# EAGLE design RG_Medium_Matrix-v11 (EAGLE 6.4)
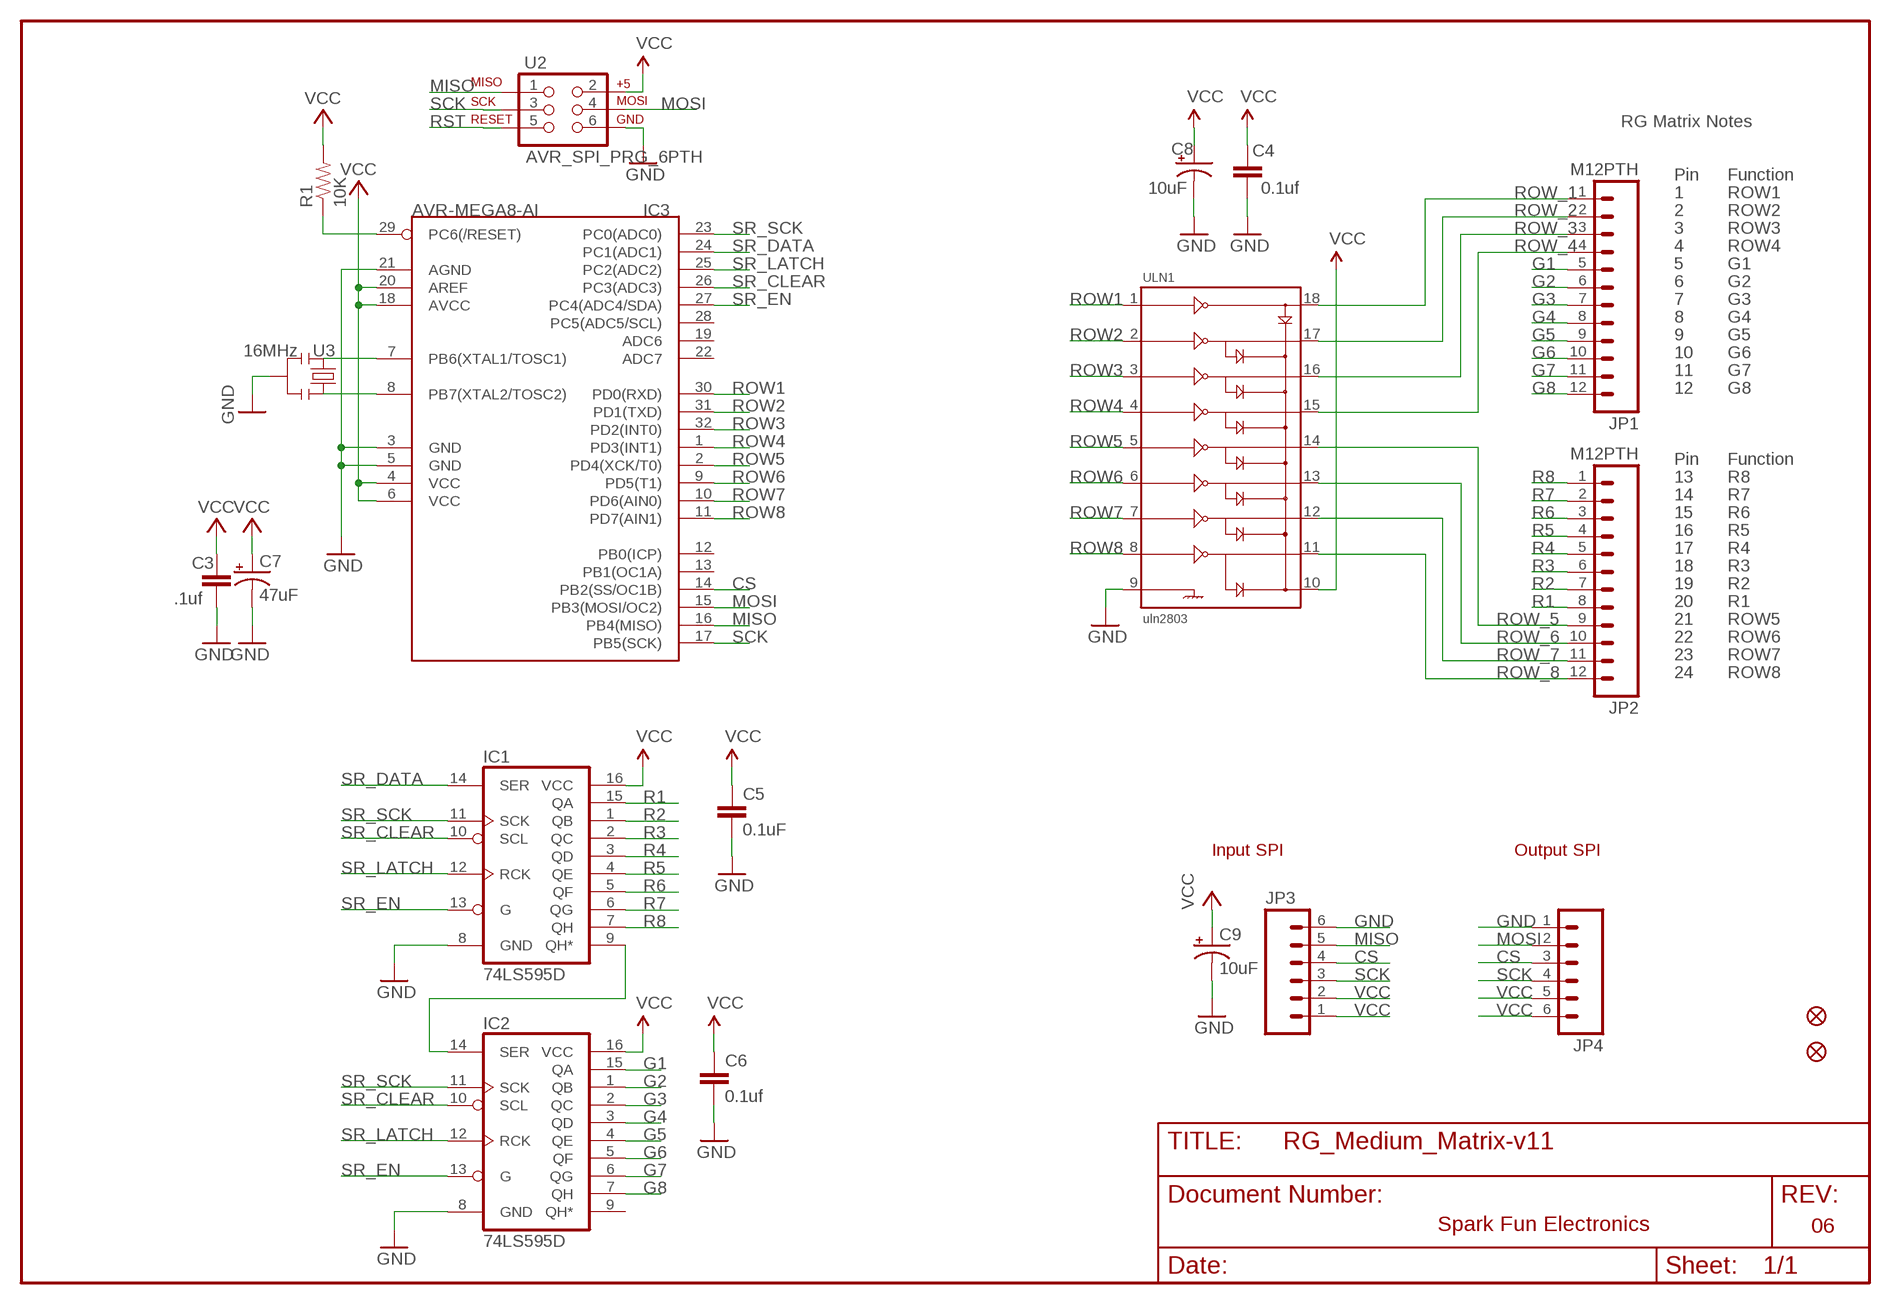
[diagram p0: schematic, sheet 1]

## Parts
C3  .1uf  CAP0402  [C0402]
C4  0.1uf  CAP0402  [C0402]
C5  0.1uF  CAP0402  [C0402]
C6  0.1uf  CAP0402  [C0402]
C7  47uF  CAP_POL3528  [EIA3528]
C8  10uF  CAP_POL1206  [EIA3216]
C9  10uF  CAP_POL1206  [EIA3216]
IC1  74LS595D  [SO16]
IC2  74LS595D  [SO16]
IC3  AVR-MEGA8-AI  [TQFP32-08]
JP1  M12PTH  [1X12]
JP2  M12PTH  [1X12]
JP3  M06SMD  [1X06-SMD]
JP4  M06SIP  [1X06]
R1  10K  RESISTOR0402  [C0402]
U2  AVR_SPI_PRG_6PTH  [2X3]
U3  16MHz  RESONATORSMD  [RESONATOR-SMD]
U$1  FIDUCIAL1X2  [FIDUCIAL-1X2]
U$3  FIDUCIAL1X2  [FIDUCIAL-1X2]
ULN1  uln2803  ULN2803SOICW  [SO18L]

## Nets
CS: IC3.14(PB2(SS/OC1B)) JP3.4 JP4.3
G1: IC2.15(QA) JP1.5
G2: IC2.1(QB) JP1.6
G3: IC2.2(QC) JP1.7
G4: IC2.3(QD) JP1.8
G5: IC2.4(QE) JP1.9
G6: IC2.5(QF) JP1.10
G7: IC2.6(QG) JP1.11
G8: IC2.7(QH) JP1.12
GND: C3.2 C4.1 C5.2 C6.2 C7.C(-) C8.C(-) C9.C(-) IC1.8(GND) IC2.8(GND) IC3.3(GND) IC3.5(GND) IC3.21(AGND) JP3.6 JP4.1 U2.6 U3.2 ULN1.9
MISO: IC3.16(PB4(MISO)) JP3.5 U2.1
MOSI: IC3.15(PB3(MOSI/OC2)) JP4.2 U2.4
N$1: IC3.7(PB6(XTAL1/TOSC1)) U3.1
N$2: IC3.8(PB7(XTAL2/TOSC2)) U3.3
N$30: IC1.9(QH*) IC2.14(SER)
R1: IC1.15(QA) JP2.8
R2: IC1.1(QB) JP2.7
R3: IC1.2(QC) JP2.6
R4: IC1.3(QD) JP2.5
R5: IC1.4(QE) JP2.4
R6: IC1.5(QF) JP2.3
R7: IC1.6(QG) JP2.2
R8: IC1.7(QH) JP2.1
ROW1: IC3.30(PD0(RXD)) ULN1.1
ROW2: IC3.31(PD1(TXD)) ULN1.2
ROW3: IC3.32(PD2(INT0)) ULN1.3
ROW4: IC3.1(PD3(INT1)) ULN1.4
ROW5: IC3.2(PD4(XCK/T0)) ULN1.5
ROW6: IC3.9(PD5(T1)) ULN1.6
ROW7: IC3.10(PD6(AIN0)) ULN1.7
ROW8: IC3.11(PD7(AIN1)) ULN1.8
ROW_1: JP1.1 ULN1.18
ROW_2: JP1.2 ULN1.17
ROW_3: JP1.3 ULN1.16
ROW_4: JP1.4 ULN1.15
ROW_5: JP2.9 ULN1.14
ROW_6: JP2.10 ULN1.13
ROW_7: JP2.11 ULN1.12
ROW_8: JP2.12 ULN1.11
RST: IC3.29(PC6(/RESET)) R1.1 U2.5
SCK: IC3.17(PB5(SCK)) JP3.3 JP4.4 U2.3
SR_CLEAR: IC1.10(SCL) IC2.10(SCL) IC3.26(PC3(ADC3))
SR_DATA: IC1.14(SER) IC3.24(PC1(ADC1))
SR_EN: IC1.13(G) IC2.13(G) IC3.27(PC4(ADC4/SDA))
SR_LATCH: IC1.12(RCK) IC2.12(RCK) IC3.25(PC2(ADC2))
SR_SCK: IC1.11(SCK) IC2.11(SCK) IC3.23(PC0(ADC0))
VCC: C3.1 C4.2 C5.1 C6.1 C7.A(+) C8.A(+) C9.A(+) IC1.16(VCC) IC2.16(VCC) IC3.4(VCC) IC3.6(VCC) IC3.18(AVCC) IC3.20(AREF) JP3.1 JP3.2 JP4.5 JP4.6 R1.2 U2.2 ULN1.10
Unconnected: IC2.9(QH*) IC3.12(PB0(ICP)) IC3.13(PB1(OC1A)) IC3.19(ADC6) IC3.22(ADC7) IC3.28(PC5(ADC5/SCL))

## Notes on the sheet
- RG Matrix Notes
- Pin | Function
- 1 | ROW1
- 2 | ROW2
- 3 | ROW3
- 4 | ROW4
- 5 | G1
- 6 | G2
- 7 | G3
- 8 | G4
- 9 | G5
- 10 | G6
- 11 | G7
- 12 | G8
- Pin | Function
- 13 | R8
- 14 | R7
- 15 | R6
- 16 | R5
- 17 | R4
- 18 | R3
- 19 | R2
- 20 | R1
- 21 | ROW5
- 22 | ROW6
- 23 | ROW7
- 24 | ROW8
- Input SPI | Output SPI
- Spark Fun Electronics | 06

## Library data of the parts
C3-C6 = SparkFun:CAP: Capacitor Standard 0603 ceramic capacitor, and 0.1" leaded capacitor.
C7-C9 = SparkFun:CAP_POL: Capacitor Polarized These are standard SMD and PTH capacitors. Normally 10uF, 47uF, and 100uF in electrolytic and tantalum varieties. Always verify the external diameter of the through hole cap, it varies with capacity, voltage, and manufacturer. The EIA devices should be standard.
IC1 IC2 = SparkFun:74*595: 8-bit SHIFT REGISTER, output latch
IC3 = SparkFun:AVR-MEGA8: MICROCONTROLLER 8 Kbytes FLASH 1 kbytes SRAM 512 bytes EEPROM USART 6-channel 10 bit ADC 2-channel 8 bit ADC
JP1 JP2 = SparkFun:M12: Header 12 Standard 12-pin 0.1" header. Use with straight break away headers (SKU : PRT-00116), right angle break away headers (PRT-00553), swiss pins (PRT-00743), machine pins (PRT-00117), and female headers (PRT-00115).
JP3 JP4 = SparkFun:M06: Header 6 Standard 6-pin 0.1" header. Use with straight break away headers (SKU : PRT-00116), right angle break away headers (PRT-00553), swiss pins (PRT-00743), machine pins (PRT-00117), and female headers (PRT-00115). Molex polarized connector foot print use with SKU : PRT-08094 with associated crimp pins and housings. NOTES ON THE VARIANTS LOCK and LOCK_LONGPADS... This footprint was designed to help hold the alignment of a through-hole component (i.e. 6-pin header) while soldering it into place. You may notice that each hole has been shifted either up or down by 0.005 of an inch from it's more standard position (which is a perfectly straight line). This slight alteration caused the pins (the squares in the middle) to touch the edges of the holes. Because they are alternating, it causes a "brace" to hold the component in place. 0.005 has proven to be the perfect amount of "off-center" position when using our standard breakaway headers. Although looks a little odd when you look at the bare footprint, once you have a header in there, the alteration is very hard to notice. Also, if you push a header all the way into place, it is covered up entirely on the bottom side. This idea of altering the position of holes to aid alignment will be further integrated into the Sparkfun Library for other footprints. It can help hold any component with 3 or more connection pins.
R1 = SparkFun:RESISTOR: Resistor Basic schematic elements and footprints for 0603, 1206, and PTH 1/10th watt (small) resistors.
U2 = SparkFun:AVR_SPI_PRG_6: AVR ISP 6 Pin This is the reduced ISP connector for AVR programming. Common on Arduino. This footprint will take up less PCB space and can be used with a 10-pin to 6-pin adapter such as SKU: BOB-08508
U3 = SparkFun:RESONATOR: Resonator Small SMD resonator. This is the itty bitty 10/20MHz resonators with built in caps. CSTCE10M0G55 and CSTCE20M0V53. Footprint has been reviewed closely but hasn't been tested yet.
U$1 U$3 = SparkFun:FIDUCIAL: Fiducial Alignment Points Various fiducial points for machine vision alignment.
ULN1 = SparkFun:ULN2803: Darlington Driver ULN2803 Darlington array. 500mA max per channel, 8-channel package. Spark Fun Electronics SKU : COM-00312

## Net classes
0 DEFAULT: width 0.203 mm
1 power: width 0.356 mm

## Board
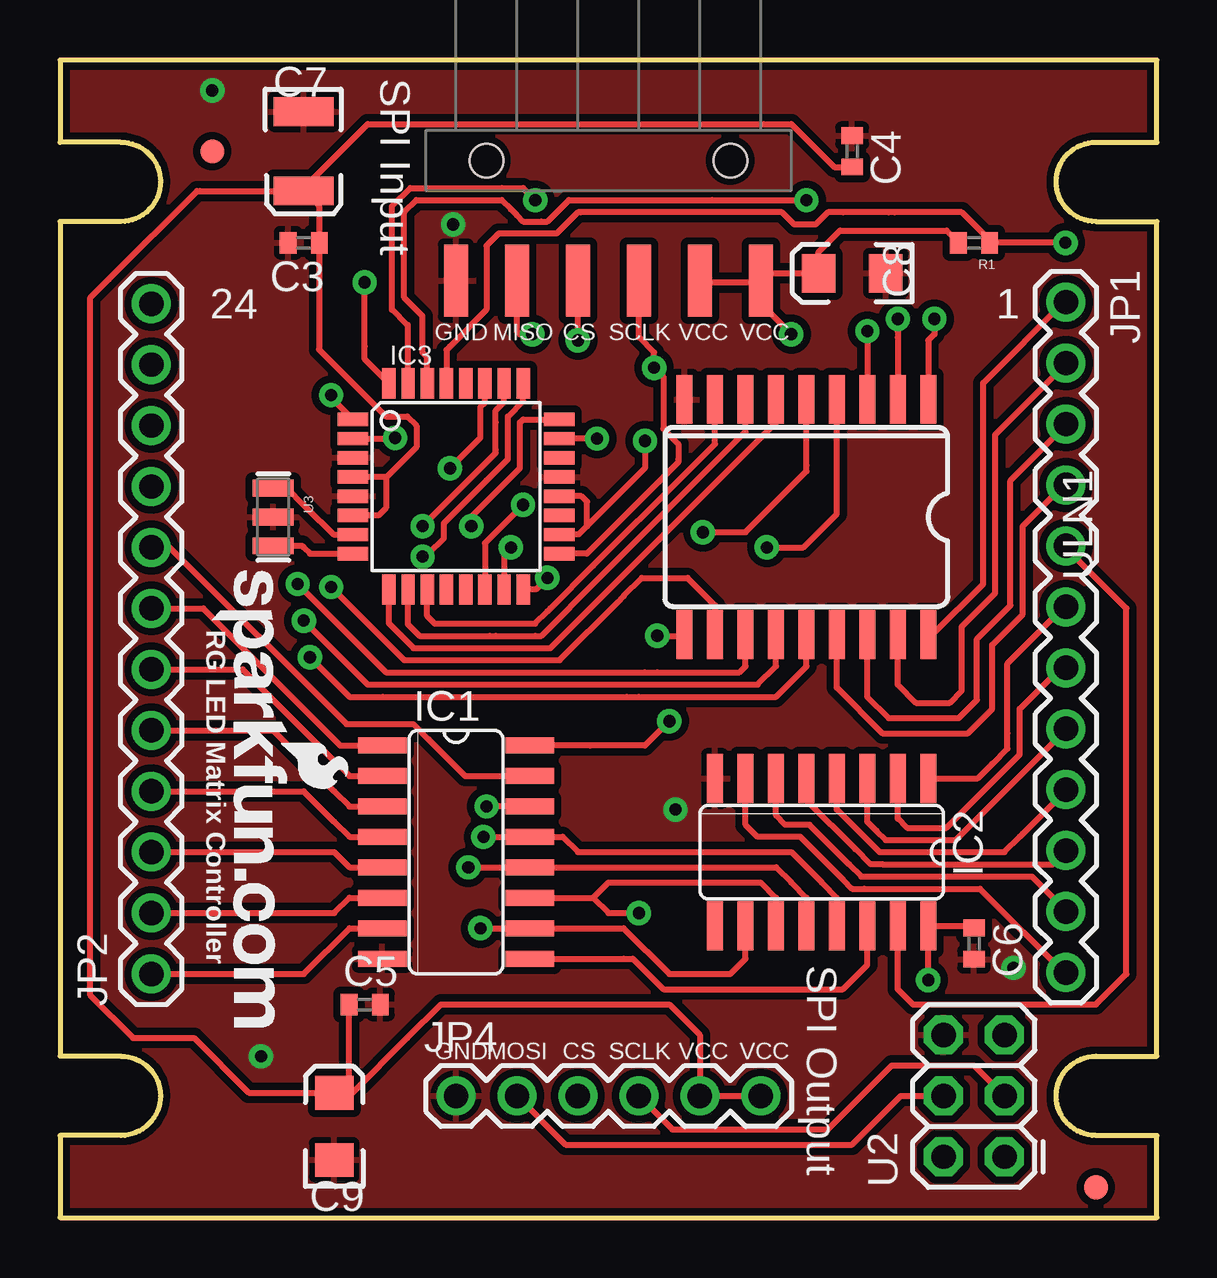
[diagram p1: board, top side]
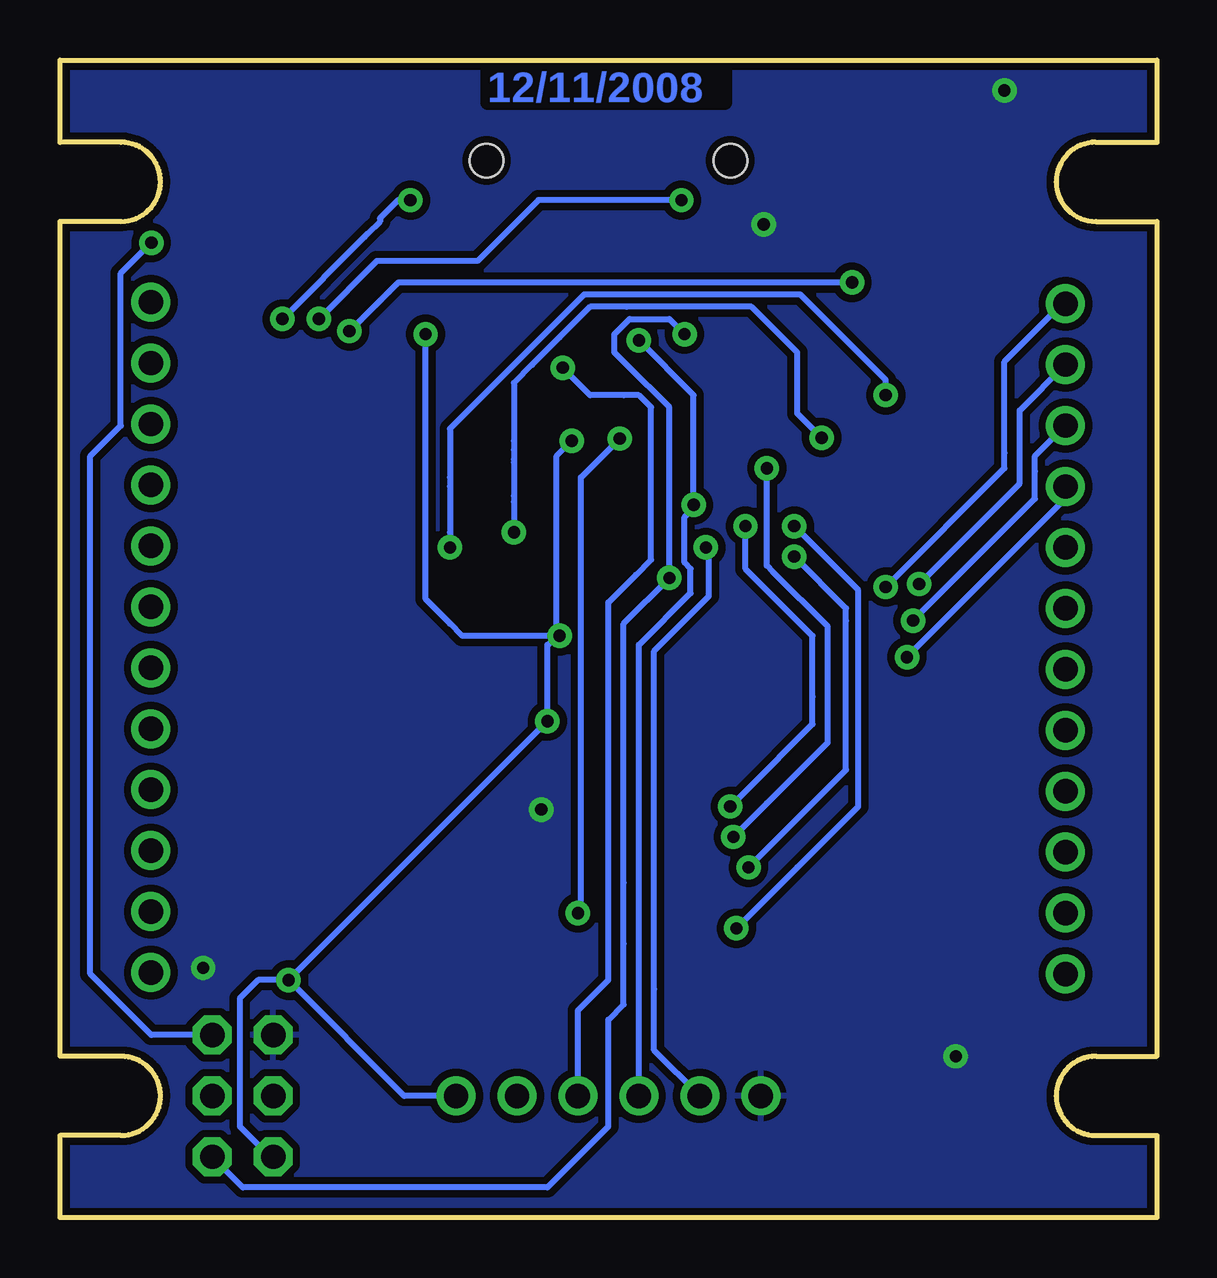
[diagram p2: board, bottom side, seen from below]

Size 45.72 x 48.26 mm. Coordinates in mm from the lower left corner, seen from the top.
Outline: 0,0 45.72,0 45.72,3.43 43.18,3.43 arc-180 43.18,6.73 45.72,6.73 45.72,41.53 43.18,41.53 arc-180 43.18,44.83 45.72,44.83 45.72,48.26 0,48.26 0,44.83 2.54,44.83 arc-180 2.54,41.53 0,41.53 0,6.73 2.54,6.73 arc-180 2.54,3.43 0,3.43 0,0
Copper layers (1*16): Top 0.035mm / dielectric 1.5mm / Bottom 0.035mm
Design rules "SparkFun *": minimum track width 8mil, minimum drill 20mil, track to track 8mil, track to pad 8mil, pad to pad 8mil, via to via 8mil, smd to smd 8mil, copper to edge 10mil, drill to drill 8mil, minimum pad ring 12mil, minimum via ring 10mil, stop-mask expansion 4mil, vias tented up to drill 20mil, thermal gap 10mil

### Footprints (pad centres in the part's own frame; a part is rotated, then mirrored left to right if it is on the bottom)
C0402 = smd 0.7 x 0.9: 1 -0.65,0; 2 0.65,0
EIA3528 = smd 1.2 x 2.5: A 1.65,0; C -1.65,0
EIA3216 = smd 1.4 x 1.6: A 1.4,0; C -1.4,0
SO16 = smd 0.66 x 2.032: 1 -4.445,-3.073; 2 -3.175,-3.073; 3 -1.905,-3.073; 4 -0.635,-3.073; 5 0.635,-3.073; 6 1.905,-3.073; 7 3.175,-3.073; 8 4.445,-3.073; 9 4.445,3.073; 10 3.175,3.073; 11 1.905,3.073; 12 0.635,3.073; 13 -0.635,3.073; 14 -1.905,3.073; 15 -3.175,3.073; 16 -4.445,3.073
TQFP32-08 = smd 1.27 x 0.559: 1 -4.293,2.8; 2 -4.293,2; 3 -4.293,1.2; 4 -4.293,0.4; 5 -4.293,-0.4; 6 -4.293,-1.2; 7 -4.293,-2; 8 -4.293,-2.8; 17 4.293,-2.8; 18 4.293,-2; 19 4.293,-1.2; 20 4.293,-0.4; 21 4.293,0.4; 22 4.293,1.2; 23 4.293,2; 24 4.293,2.8 | smd 0.559 x 1.27: 9 -2.8,-4.293; 10 -2,-4.293; 11 -1.2,-4.293; 12 -0.4,-4.293; 13 0.4,-4.293; 14 1.2,-4.293; 15 2,-4.293; 16 2.8,-4.293; 25 2.8,4.293; 26 2,4.293; 27 1.2,4.293; 28 0.4,4.293; 29 -0.4,4.293; 30 -1.2,4.293; 31 -2,4.293; 32 -2.8,4.293
1X12 = drill 1.016: 1 0,0; 2 2.54,0; 3 5.08,0; 4 7.62,0; 5 10.16,0; 6 12.7,0; 7 15.24,0; 8 17.78,0; 9 20.32,0; 10 22.86,0; 11 25.4,0; 12 27.94,0
1X06-SMD = smd 1 x 3: 1 -6.35,5; 2 -3.81,5; 3 -1.27,5; 4 1.27,5; 5 3.81,5; 6 6.35,5 | hole 1.4: -5.08,0; 5.08,0
1X06 = drill 1.016: 1 0,0; 2 2.54,0; 3 5.08,0; 4 7.62,0; 5 10.16,0; 6 12.7,0
2X3 = drill 1.016 octagon: 1 0,0; 2 0,2.54; 3 2.54,0; 4 2.54,2.54; 5 5.08,0; 6 5.08,2.54
RESONATOR-SMD = smd 0.7 x 1.7: 1 -1.2,0; 2 0,0; 3 1.2,0
FIDUCIAL-1X2 = smd 1 x 1: 1 0,0
SO18L = smd 0.66 x 2.032: 1 -0.635,-4.902; 2 0.635,-4.902; 3 1.905,-4.902; 4 3.175,-4.902; 5 4.445,-4.902; 6 5.715,-4.902; 7 6.985,-4.902; 8 8.255,-4.902; 9 9.525,-4.902; 10 9.525,4.902; 11 8.255,4.902; 12 6.985,4.902; 13 5.715,4.902; 14 4.445,4.902; 15 3.175,4.902; 16 1.905,4.902; 17 0.635,4.902; 18 -0.635,4.902

### Placement (x,y rotation side)
C3  10.16,40.64 180 top
C4  33.02,44.45 270 top
C5  12.7,8.89 0 top
C6  38.1,11.43 270 top
C7  10.16,44.45 270 top
C8  33.02,39.37 180 top
C9  11.43,3.81 90 top
IC1  16.51,15.24 270 top
IC2  31.75,15.24 180 top
IC3  16.51,30.48 0 top
JP1  41.93,38.16 270 top
JP2  3.81,10.16 90 top
JP3  22.86,44.07 180 top
JP4  16.51,5.08 0 top
R1  38.1,40.64 180 top
U2  39.37,2.54 90 top
U3  8.89,29.21 270 top
U$1  6.35,44.45 0 top
U$3  43.18,1.27 0 top
U$8  [SFE-NEW-WEBLOGO]  6.33,26.98 270 top
ULN1  35.56,29.21 180 top

### Tracks (layer width: path | path; a pad name or v marks a point on that pad's centre or on a via)
CS  (via drill 0.51)
  Top 0.254: v21.59,36.58 JP3.4 | IC3.14 17.71,28.12 v19.3,29.72
  Bottom 0.254: 19.3,29.59 v19.3,29.72 | 19.3,29.59 19.43,29.46 | 19.56,29.34 19.3,29.59 | 19.3,29.59 v19.3,29.72 | v19.3,29.72 19.3,34.29 v21.59,36.58 | 19.56,29.34 19.3,29.59 | 19.3,29.59 v19.3,29.72 | 19.56,29.34 19.68,29.21 19.68,27.3 19.43,27.05 19.43,26.04 21.59,23.88 JP4.3
G1
  Top 0.254: IC2.15 34.92,9.53 35.56,8.89 43.18,8.89 44.45,10.16 44.45,25.4 41.91,27.94 41.93,27.96 JP1.5
G2
  Top 0.254: IC2.1 38.25,18.31 38.86,18.92 39.5,19.56 39.5,20.19 39.5,23.11 41.91,25.53 41.93,25.5 JP1.6
G3
  Top 0.254: IC2.2 34.92,16.64 35.31,16.26 36.96,16.26 37.34,16.64 40.01,19.3 40.01,21.21 41.78,22.99 41.91,22.99 41.91,22.95 JP1.7
G4
  Top 0.254: IC2.3 33.66,17.02 33.66,16.51 34.04,16.13 34.42,15.75 35.56,15.75 37.34,15.75 37.97,16.38 38.1,16.51 41.91,20.32 41.93,20.34 JP1.8
G5
  Top 0.254: IC2.4 32.38,17.02 33.4,16 34.16,15.24 34.8,15.24 39.37,15.24 40.01,15.88 40.13,16 41.91,17.78 41.93,17.8 JP1.9
G6
  Top 0.254: IC2.5 31.11,17.4 33.15,15.37 33.78,14.73 34.29,14.73 41.4,14.73 42.04,15.37 41.97,15.3 JP1.10
G7
  Top 0.254: IC2.6 29.84,16.76 30.23,16.38 31.24,16.38 32.89,14.73 33.4,14.22 34.16,14.22 40.51,14.22 41.91,12.83 41.93,12.8 JP1.11
G8
  Top 0.254: IC2.7 28.57,16.38 29.08,15.88 30.86,15.88 32.64,14.1 33.02,13.72 33.53,13.72 38.35,13.72 41.91,10.16 41.93,10.18 JP1.12
GND  (via drill 0.51)
  other vias: 39.75,10.41 25.65,17.02 8.38,6.73 16.38,41.4 6.35,46.99
  pour Top (isolate 0.305): 0,48.27 45.72,48.25 45.72,0 0,0
  pour Bottom (isolate 0.305): -0.02,0 45.71,0 45.74,48.26 -0.03,48.28
MISO  (via drill 0.51)
  Top 0.254: IC3.16 19.84,26.19 v20.32,26.67 | v19.68,36.83 19.18,36.83 19.05,36.96 JP3.5
  Bottom 0.254: v19.68,36.83 20.32,37.47 21.97,37.47 22.61,36.83 22.61,36.07 22.23,35.69 22.1,35.56 20.32,33.78 v20.32,26.67 22.23,24.77 22.23,13.97 22.23,11.43 22.23,8.89 22.86,8.26 22.86,3.81 25.4,1.27 38.1,1.27 U2.1
MOSI  (via drill 0.51)
  Top 0.254: IC3.15 18.51,27.65 v18.8,27.94 | U2.4 35.05,5.08 33.02,3.05 21.08,3.05 JP4.2
  Bottom 0.254: v18.8,27.94 18.67,27.81 18.67,25.91 20.95,23.62 20.95,9.53 20.95,6.99 JP4.2
N$1
  Top 0.254: IC3.7 11.4,28.48 10.29,29.59 10.16,29.72 9.47,30.41 U3.1
N$2
  Top 0.254: IC3.8 10.42,27.68 10.16,27.94 10.09,28.01 U3.3
N$30
  Top 0.254: IC1.9 23.5,10.79 23.88,10.79 25.15,9.53 32.64,9.53 33.66,10.54 33.66,10.79 IC2.14
R1
  Top 0.254: IC1.15 16.89,18.41 15.37,19.94 14.73,20.57 11.94,20.57 4.57,27.94 4.06,27.94 JP2.8
R2
  Top 0.254: IC1.1 11.68,19.68 11.18,20.19 5.97,25.4 JP2.7
R3
  Top 0.254: IC1.2 12.06,18.41 11.43,19.05 7.62,22.86 JP2.6
R4
  Top 0.254: IC1.3 12.06,17.14 11.43,17.78 8.89,20.32 JP2.5
R5
  Top 0.254: IC1.4 12.06,15.88 11.43,16.51 10.16,17.78 JP2.4
R6
  Top 0.254: IC1.5 12.06,14.61 11.43,15.24 JP2.3
R7
  Top 0.254: IC1.6 12.06,13.34 11.43,12.7 JP2.2
R8
  Top 0.254: IC1.7 12.06,12.06 10.16,10.16 JP2.1
ROW1  (via drill 0.51)
  Top 0.254: v36.45,37.47 36.45,36.96 36.45,36.83 36.2,36.58 ULN1.1 | v31.11,42.42 27.18,42.42 21.21,42.42 20.32,41.53 20.07,41.53 19.3,41.53 19.05,41.78 18.8,42.04 18.41,42.42 14.86,42.42 14.35,41.91 14.35,38.35 15.11,37.59 15.11,36.07 15.31,35.87 IC3.30
  Bottom 0.254: v36.45,37.47 33.02,40.89 32.89,41.02 32.38,41.53 32.38,41.66 31.62,42.42 v31.11,42.42
ROW2  (via drill 0.51)
  Top 0.254: IC3.31 14.51,37.21 14.48,37.21 13.84,37.85 13.84,42.16 14.61,42.93 18.41,42.93 19.3,42.93 v19.81,42.42 | v34.92,37.47 34.92,36.96 34.92,36.7 ULN1.2
  Bottom 0.254: v34.92,37.47 32.51,39.88 32.26,39.88 28.32,39.88 25.78,42.42 v19.81,42.42
ROW3  (via drill 0.51)
  Top 0.254: v33.66,36.96 ULN1.3 | IC3.32 12.7,35.78 12.7,36.32 12.7,38.86 v12.7,38.99
  Bottom 0.254: v12.7,38.99 31.62,38.99 v33.66,36.96
ROW4  (via drill 0.51)
  Top 0.254: v29.46,27.94 29.84,27.94 30.99,27.94 31.24,28.19 32.38,29.34 32.38,30.23 32.38,30.48 32.38,30.61 ULN1.4 | IC3.1 11.3,34.19 v11.3,34.29
  Bottom 0.254: v29.46,27.94 29.46,28.19 29.46,28.57 29.46,30.48 29.46,30.86 29.46,32.89 27.05,35.31 25.15,37.21 23.88,38.48 16.38,38.48 14.86,38.48 13.59,37.21 13.46,37.08 11.3,34.92 v11.3,34.29
ROW5  (via drill 0.51)
  Top 0.254: v26.8,28.57 28.57,28.57 31.11,31.11 31.11,31.37 ULN1.5 | IC3.2 13.94,32.48 v13.97,32.51
  Bottom 0.254: v26.8,28.57 26.8,28.7 26.8,29.84 26.8,30.1 26.8,31.5 26.8,31.62 26.8,32 26.8,32.38 26.8,34.8 26.04,35.56 24.89,36.7 23.62,37.97 22.1,37.97 16.89,37.97 14.99,36.07 14.99,33.53 14.1,32.64 v13.97,32.51
ROW6
  Top 0.254: ULN1.6 29.84,33.15 22.86,26.16 20.45,23.75 19.81,23.75 17.14,23.75 16.89,23.75 14.73,23.75 13.71,24.77 IC3.9
ROW7
  Top 0.254: ULN1.7 28.57,32.77 27.69,31.88 22.48,26.67 20.07,24.26 19.81,24.26 18.16,24.26 17.91,24.26 14.99,24.26 14.51,24.73 IC3.10
ROW8
  Top 0.254: ULN1.8 27.3,32.26 26.04,30.99 22.23,27.18 20.45,25.4 20.32,25.27 19.81,24.77 18.92,24.77 18.54,24.77 18.16,24.77 15.62,24.77 15.31,25.08 IC3.11
ROW_1
  Top 0.254: ULN1.18 36.37,24.31 38.48,26.42 38.48,34.8 41.91,38.23 41.93,38.2 JP1.1
ROW_2
  Top 0.254: ULN1.17 34.92,22.23 35.69,21.46 37.08,21.46 37.59,21.97 37.59,24.64 38.99,26.04 38.99,32.64 41.91,35.56 41.93,35.58 JP1.2
ROW_3
  Top 0.254: ULN1.16 33.66,21.72 34.54,20.83 37.47,20.83 38.23,21.59 38.23,24.13 39.62,25.53 39.62,30.73 41.91,33.02 41.93,33.04 JP1.3
ROW_4
  Top 0.254: ULN1.15 32.38,22.1 34.29,20.19 37.85,20.19 38.86,21.21 38.86,23.88 40.13,25.15 40.13,28.83 41.91,30.61 41.93,30.59 JP1.4
ROW_5  (via drill 0.51)
  Top 0.254: ULN1.14 31.11,22.99 29.84,21.72 24.13,21.72 23.62,21.72 13.46,21.72 12.06,21.72 v10.41,23.37
  Bottom 0.254: v10.41,23.37 3.81,29.97 JP2.9
ROW_6  (via drill 0.51)
  Top 0.254: ULN1.13 29.84,22.99 29.08,22.23 24.51,22.23 24,22.23 12.83,22.23 10.67,24.38 v10.16,24.89
  Bottom 0.254: v10.16,24.89 5.08,29.97 5.08,31.11 5.08,31.75 JP2.10
ROW_7  (via drill 0.51)
  Top 0.254: ULN1.12 28.57,22.99 28.32,22.73 24.89,22.73 24.38,22.73 13.59,22.73 11.3,25.02 v9.91,26.42
  Bottom 0.254: v9.91,26.42 5.71,30.61 5.71,31.75 5.71,33.66 JP2.11
ROW_8  (via drill 0.51)
  Top 0.254: ULN1.11 27.3,25.53 26.16,26.67 24.26,26.67 23.5,25.91 23.24,25.65 20.83,23.24 20.32,23.24 19.94,23.24 14.35,23.24 11.94,25.65 v11.3,26.29
  Bottom 0.254: v11.3,26.29 6.35,31.24 6.35,31.88 6.35,35.69 3.94,38.1 JP2.12
RST  (via drill 0.51)
  Top 0.254: IC3.29 16.11,36.18 16.26,36.32 17.78,37.85 17.78,40.51 18.29,41.02 20.7,41.02 21.08,41.4 21.59,41.91 21.72,41.91 30.1,41.91 30.61,41.4 31.24,41.4 31.5,41.4 32,41.91 32.64,41.91 34.54,41.91 34.8,41.91 37.59,41.91 38.73,40.77 38.75,40.75 R1.1 41.78,40.64 v41.91,40.64
  Bottom 0.254: v41.91,40.64 43.18,39.37 43.18,33.02 44.45,31.75 44.45,10.16 41.91,7.62 U2.5
SCK  (via drill 0.51)
  Top 0.254: IC3.17 21.96,27.68 22.99,28.7 24.77,30.48 25.78,31.5 25.78,31.62 25.78,32.26 25.15,32.89 25.15,35.05 v24.77,35.43 24.77,36.07 24.13,36.7 JP3.3 | U2.3 38.1,6.35 37.85,6.35 34.67,6.35 32,3.68 25.53,3.68 24.26,4.95 JP4.4
  Bottom 0.254: v24.77,35.43 23.62,34.29 22.23,34.29 21.59,34.29 21.08,33.78 21.08,27.43 21.72,26.8 22.86,25.65 22.86,10.03 22.86,9.91 24.13,8.64 JP4.4
SR_CLEAR  (via drill 0.51)
  Top 0.254: IC2.10 28.57,10.79 27.94,10.16 25.4,10.16 23.5,12.06 IC1.10 19.18,12.06 v17.53,12.06 | v15.11,28.83 15.24,28.96 16.76,30.48 18.16,31.88 18.16,32 18.16,33.15 18.16,33.66 18.51,34 IC3.26
  Bottom 0.254: v17.53,12.06 14.99,14.61 12.45,17.14 12.45,20.57 12.45,26.16 14.99,28.7 v15.11,28.83
SR_DATA  (via drill 0.51)
  Top 0.254: IC3.24 19.31,33.28 19.18,33.15 19.18,31.24 18.41,30.48 17.14,29.21 v17.14,28.83 | IC1.14 17.91,17.14 v17.78,17.14
  Bottom 0.254: v17.78,17.14 17.14,17.78 14.35,20.57 14.35,21.72 14.35,24.26 17.14,27.05 17.14,28.45 v17.14,28.83
SR_EN  (via drill 0.51)
  Top 0.254: IC2.13 32.38,13.34 31.75,13.97 30.48,15.24 21.59,15.24 20.95,15.88 IC1.13 19.43,15.88 v17.65,15.88 | IC3.27 17.71,33.97 17.53,33.78 17.53,32.51 v16.26,31.24
  Bottom 0.254: v17.65,15.88 16.26,17.27 13.72,19.81 13.72,21.59 13.72,24.64 16,26.92 16.26,27.18 16.26,31.11 v16.26,31.24
SR_LATCH  (via drill 0.51)
  Top 0.254: IC2.12 31.11,13.34 30.48,13.97 29.84,14.61 IC1.12 19.43,14.61 v17.02,14.61 | IC3.25 19.31,34.04 18.67,33.4 18.67,31.62 17.78,30.73 16,28.96 16,28.45 16,28.32 15.37,27.69 15.24,27.56 v15.11,27.56
  Bottom 0.254: v15.11,27.56 12.95,25.4 12.95,24.89 12.95,18.67 v17.02,14.61
SR_SCK  (via drill 0.51)
  Top 0.254: IC1.11 22.23,13.34 | 22.23,13.34 22.86,13.97 29.21,13.97 29.84,13.34 IC2.11 | v24.13,12.7 22.86,12.7 22.23,13.34 | IC3.23 22.13,32.48 v22.38,32.48
  Bottom 0.254: v24.13,12.7 24,12.83 24,28.7 24,30.86 v22.38,32.48
VCC  (via drill 0.51)
  Top 0.254: C6.1 38.1,12.06 38,12.17 IC2.16 v36.2,9.91 | IC1.16 22.1,19.68 24.38,19.68 v25.4,20.7 | ULN1.10 26.04,24.26 v24.89,24.26 | C8.A | C8.A 31.62,40.26 32.51,41.15 36.96,41.15 37.47,40.64 R1.2 | C9.A 12.05,5.83 C5.1 | JP3.1 29.21,38.99 29.21,38.1 v30.48,36.83 | 26.75,38.99 JP3.2 26.75,38.99 | C8.A 31.5,39.37 29.51,39.37 JP3.1 | C4.2 32.27,43.8 30.48,45.59 29.34,45.59 12.83,45.59 10.16,42.93 | 13.59,30.88 13.61,30.88 14.86,32.13 14.86,33.02 14.48,33.4 13.84,33.4 13.59,33.4 10.79,36.2 10.79,40.51 10.79,40.62 C3.1 10.79,40.66 10.79,40.89 10.79,42.16 C7.A | 13.59,30.88 IC3.4 | IC3.6 13.28,29.28 13.59,29.59 13.59,30.86 13.59,30.88 | IC3.18 21.62,28.48 21.97,28.83 | IC3.20 21.74,30.08 21.97,29.84 21.97,28.83 | 21.97,28.83 24.38,31.24 v24.38,32.38 | C9.A 11.56,5.21 12.19,5.21 14.48,7.49 15.88,8.89 24.13,8.89 25.4,8.89 26.67,7.62 JP4.5 JP4.6 | 26.75,38.99 26.92,38.99 29.13,38.99 JP3.1 | 10.16,42.93 10.16,43.18 9.78,42.8 | C7.A 10.16,42.93 | C7.A | C7.A 10.16,42.93 | C9.A 7.87,5.21 5.59,7.49 4.45,7.49 3.05,7.49 1.27,9.27 1.27,38.35 2.03,39.12 5.71,42.8 5.84,42.8 9.4,42.8 10.03,42.8 C7.A
  Bottom 0.254: v24.89,24.26 25.4,23.88 v25.4,20.7 v36.2,9.91 | v36.2,9.91 36.2,9.78 | v24.89,24.26 25.02,24.38 25.02,31.75 v24.38,32.38 | v30.48,36.83 30.48,25.78 29.46,24.77 28.96,24.26 v24.89,24.26 | U2.2 36.96,2.54 38.23,3.81 38.23,9.14 37.47,9.91 36.58,9.91 v36.2,9.91 | v36.2,9.91 31.37,5.08 JP4.6

### Text on the board
Bottom: 12/11/2008
tPlace: SPI Input | 24 | 1 | GND | MISO | CS | SCLK | VCC | VCC | RG LED Matrix Controller | SPI Output | GND | MOSI | CS | SCLK | VCC | VCC
tValues: DNP | Polarized Male 6 pin header | ATMEGA168-20AU | 12-pin Female Header | 16MHz | ULN2803 | 12-pin Female Header | NOTE: | The two sets of 12 breakout pins | should be populated with Female | breakout headers, mounted on the BACK | side of the board. (i.e. Not the component side) | DNP | RG Serial Controller
bValues: SPI/ICSP
Measures: COLUMN 8 | ROW8 | COLUMN 7 | ROW1 | ROW7 | ROW2 | ROW6 | ROW3 | COLUMN 6 | ROW5 | ROW4 | R1 | G1 | COLUMN 5 | R2 | G2 | R3 | G3 | COLUMN 4 | R4 | G4 | R5 | G5 | COLUMN 3 | R6 | G6 | R7 | G7 | COLUMN 2 | R8 | G8 | COLUMN 1 | ROW 1 | ROW 2 | ROW 3 | ROW 4 | ROW 5 | ROW 6 | ROW 7 | ROW 8